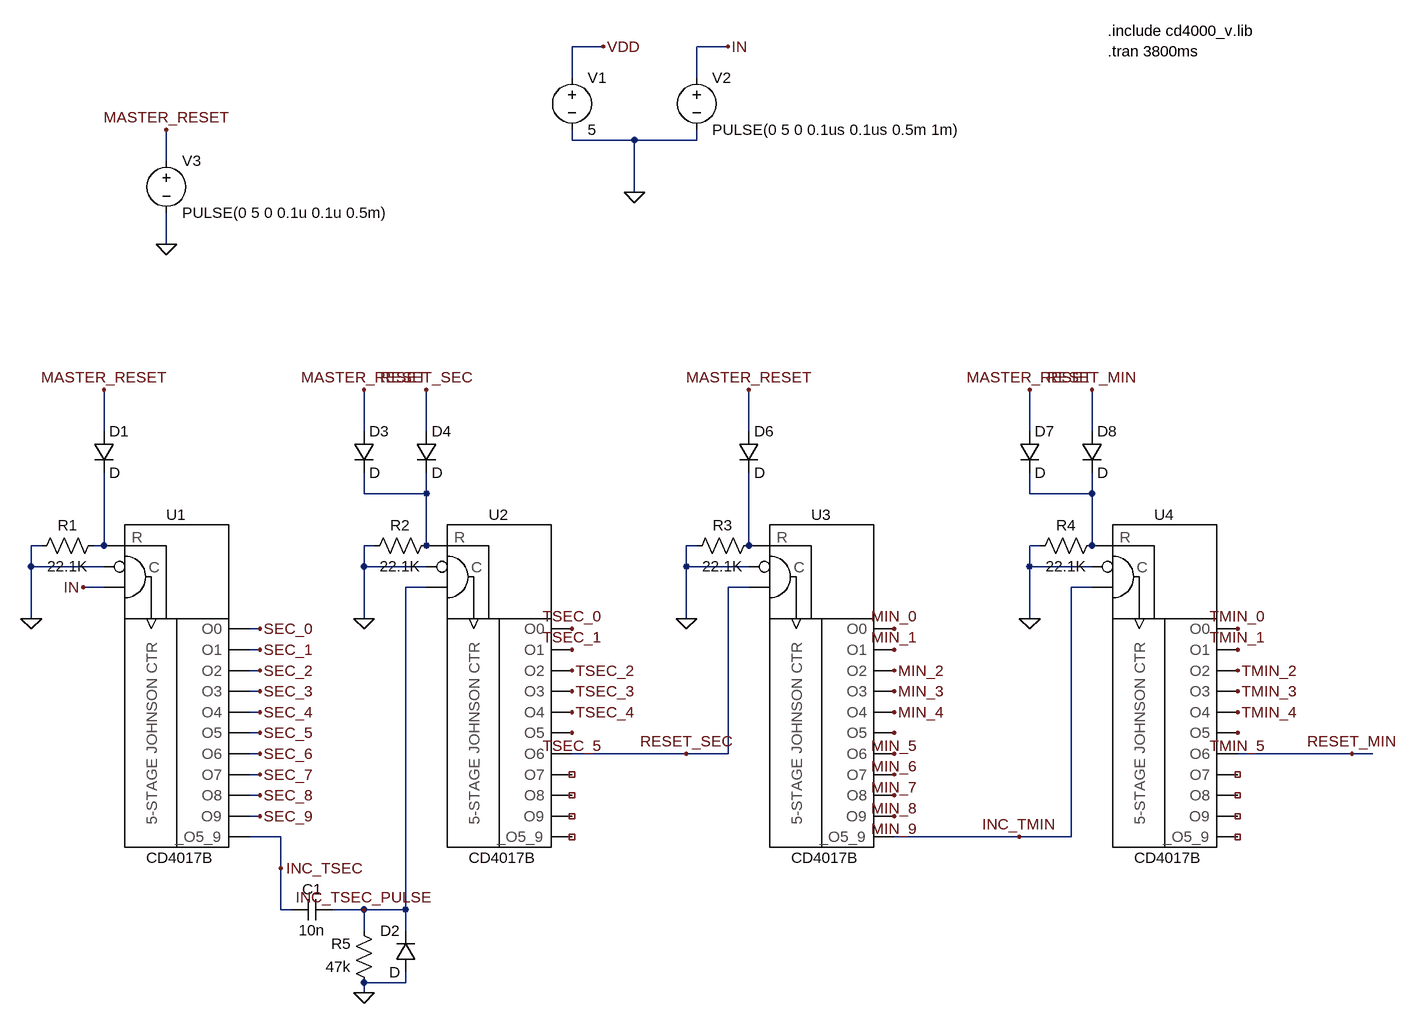
[diagram p0: schematic nixie_control.asc]
nixie_control.asc, the LTspice schematic file:
Version 4
SHEET 1 1592 1344
WIRE 368 -240 320 -240
WIRE 560 -240 512 -240
WIRE 320 -192 320 -240
WIRE 512 -192 512 -240
WIRE 320 -96 320 -112
WIRE 416 -96 320 -96
WIRE 512 -96 512 -112
WIRE 512 -96 416 -96
WIRE -304 -64 -304 -112
WIRE 416 -16 416 -96
WIRE -304 64 -304 16
WIRE -400 352 -400 288
WIRE 0 352 0 288
WIRE 96 352 96 288
WIRE 592 352 592 288
WIRE 1024 352 1024 288
WIRE 1120 352 1120 288
WIRE 0 448 0 416
WIRE 96 448 96 416
WIRE 96 448 0 448
WIRE 1024 448 1024 416
WIRE 1120 448 1120 416
WIRE 1120 448 1024 448
WIRE -496 528 -512 528
WIRE -400 528 -400 416
WIRE -400 528 -416 528
WIRE 16 528 0 528
WIRE 96 528 96 448
WIRE 512 528 496 528
WIRE 592 528 592 416
WIRE 1040 528 1024 528
WIRE 1120 528 1120 448
WIRE -512 560 -512 528
WIRE -400 560 -512 560
WIRE 0 560 0 528
WIRE 96 560 0 560
WIRE 496 560 496 528
WIRE 592 560 496 560
WIRE 1024 560 1024 528
WIRE 1120 560 1024 560
WIRE -400 592 -432 592
WIRE 96 592 64 592
WIRE 592 592 560 592
WIRE 1120 592 1088 592
WIRE -512 640 -512 560
WIRE 0 640 0 560
WIRE 496 640 496 560
WIRE 1024 640 1024 560
WIRE -160 656 -176 656
WIRE -160 688 -176 688
WIRE -160 720 -176 720
WIRE -160 752 -176 752
WIRE -160 784 -176 784
WIRE -160 816 -176 816
WIRE -160 848 -176 848
WIRE 496 848 320 848
WIRE 560 848 560 592
WIRE 560 848 496 848
WIRE 1520 848 1344 848
WIRE 1552 848 1520 848
WIRE -160 880 -176 880
WIRE -160 912 -176 912
WIRE -160 944 -176 944
WIRE -128 976 -176 976
WIRE 1008 976 816 976
WIRE 1088 976 1088 592
WIRE 1088 976 1008 976
WIRE -128 1024 -128 976
WIRE -128 1088 -128 1024
WIRE -112 1088 -128 1088
WIRE 0 1088 -48 1088
WIRE 64 1088 64 592
WIRE 64 1088 0 1088
WIRE 0 1120 0 1088
WIRE 64 1120 64 1088
WIRE 64 1200 64 1184
WIRE 64 1200 0 1200
WIRE 0 1216 0 1200
FLAG 416 -16 0
FLAG 368 -240 VDD
FLAG 560 -240 IN
FLAG -160 656 SEC_0
FLAG -160 688 SEC_1
FLAG -160 720 SEC_2
FLAG -160 752 SEC_3
FLAG -160 784 SEC_4
FLAG -160 816 SEC_5
FLAG -160 848 SEC_6
FLAG -160 880 SEC_7
FLAG -160 912 SEC_8
FLAG -160 944 SEC_9
FLAG -512 640 0
FLAG -432 592 IN
FLAG 0 640 0
FLAG 320 656 TSEC_0
FLAG 320 688 TSEC_1
FLAG 320 720 TSEC_2
FLAG 320 752 TSEC_3
FLAG 320 784 TSEC_4
FLAG 320 816 TSEC_5
FLAG 496 848 RESET_SEC
FLAG 96 288 RESET_SEC
FLAG -128 1024 INC_TSEC
FLAG -400 288 MASTER_RESET
FLAG 0 288 MASTER_RESET
FLAG -304 -112 MASTER_RESET
FLAG -304 64 0
FLAG 816 656 MIN_0
FLAG 816 688 MIN_1
FLAG 816 720 MIN_2
FLAG 816 752 MIN_3
FLAG 816 784 MIN_4
FLAG 816 816 MIN_5
FLAG 816 848 MIN_6
FLAG 816 880 MIN_7
FLAG 816 912 MIN_8
FLAG 816 944 MIN_9
FLAG 1024 640 0
FLAG 496 640 0
FLAG 1008 976 INC_TMIN
FLAG 1344 656 TMIN_0
FLAG 1344 688 TMIN_1
FLAG 1344 720 TMIN_2
FLAG 1344 752 TMIN_3
FLAG 1344 784 TMIN_4
FLAG 1344 816 TMIN_5
FLAG 592 288 MASTER_RESET
FLAG 1024 288 MASTER_RESET
FLAG 1520 848 RESET_MIN
FLAG 1120 288 RESET_MIN
FLAG 0 1088 INC_TSEC_PULSE
FLAG 0 1216 0
SYMBOL CD4017B -288 464 R0
SYMATTR InstName U1
SYMBOL voltage 320 -208 R0
SYMATTR InstName V1
SYMATTR Value 5
SYMBOL voltage 512 -208 R0
SYMATTR InstName V2
SYMATTR Value PULSE(0 5 0 0.1us 0.1us 0.5m 1m)
SYMBOL CD4017B 208 464 R0
SYMATTR InstName U2
SYMBOL res -400 512 R90
WINDOW 0 0 56 VBottom 2
WINDOW 3 32 56 VTop 2
SYMATTR InstName R1
SYMATTR Value 22.1K
SYMBOL res 112 512 R90
WINDOW 0 0 56 VBottom 2
WINDOW 3 32 56 VTop 2
SYMATTR InstName R2
SYMATTR Value 22.1K
SYMBOL diode -416 352 R0
SYMATTR InstName D1
SYMBOL diode -16 352 R0
SYMATTR InstName D3
SYMBOL diode 80 352 R0
SYMATTR InstName D4
SYMBOL voltage -304 -80 R0
SYMATTR InstName V3
SYMATTR Value PULSE(0 5 0 0.1u 0.1u 0.5m)
SYMBOL CD4017B 704 464 R0
SYMATTR InstName U3
SYMBOL CD4017B 1232 464 R0
SYMATTR InstName U4
SYMBOL res 608 512 R90
WINDOW 0 0 56 VBottom 2
WINDOW 3 32 56 VTop 2
SYMATTR InstName R3
SYMATTR Value 22.1K
SYMBOL res 1136 512 R90
WINDOW 0 0 56 VBottom 2
WINDOW 3 32 56 VTop 2
SYMATTR InstName R4
SYMATTR Value 22.1K
SYMBOL diode 576 352 R0
SYMATTR InstName D6
SYMBOL diode 1008 352 R0
SYMATTR InstName D7
SYMBOL diode 1104 352 R0
SYMATTR InstName D8
SYMBOL res 16 1216 R180
WINDOW 0 36 76 Left 2
WINDOW 3 36 40 Left 2
SYMATTR InstName R5
SYMATTR Value 47k
SYMBOL cap -48 1072 R90
WINDOW 0 0 32 VBottom 2
WINDOW 3 32 32 VTop 2
SYMATTR InstName C1
SYMATTR Value 10n
SYMBOL diode 80 1184 R180
WINDOW 0 24 64 Left 2
WINDOW 3 24 0 Left 2
SYMATTR InstName D2
TEXT 1144 -264 Left 2 !.include cd4000_v.lib\n.tran 3800ms

The netlist it stands for:
* nixie_control.asc
XU1 N003 0 IN SEC_0 SEC_1 SEC_2 SEC_3 SEC_4 SEC_5 SEC_6 SEC_7 SEC_8 SEC_9 INC_TSEC VDD 0 CD4017B VDD=5  SPEED=1.0  TRIPDT=5e-9  ; pins MR CPN CP Q0 Q1 Q2 Q3 Q4 Q5 Q6 Q7 Q8 Q9 Q59
V1 VDD 0 5
V2 IN 0 PULSE(0 5 0 0.1us 0.1us 0.5m 1m)
XU2 N001 0 INC_TSEC_PULSE TSEC_0 TSEC_1 TSEC_2 TSEC_3 TSEC_4 TSEC_5 RESET_SEC NC_01 NC_02 NC_03 NC_04 VDD 0 CD4017B VDD=5  SPEED=1.0  TRIPDT=5e-9  ; pins MR CPN CP Q0 Q1 Q2 Q3 Q4 Q5 Q6 Q7 Q8 Q9 Q59
R1 N003 0 22.1K
R2 N001 0 22.1K
D1 MASTER_RESET N003 D
D3 MASTER_RESET N001 D
D4 RESET_SEC N001 D
V3 MASTER_RESET 0 PULSE(0 5 0 0.1u 0.1u 0.5m)
XU3 N004 0 RESET_SEC MIN_0 MIN_1 MIN_2 MIN_3 MIN_4 MIN_5 MIN_6 MIN_7 MIN_8 MIN_9 INC_TMIN VDD 0 CD4017B VDD=5  SPEED=1.0  TRIPDT=5e-9  ; pins MR CPN CP Q0 Q1 Q2 Q3 Q4 Q5 Q6 Q7 Q8 Q9 Q59
XU4 N002 0 INC_TMIN TMIN_0 TMIN_1 TMIN_2 TMIN_3 TMIN_4 TMIN_5 RESET_MIN NC_05 NC_06 NC_07 NC_08 VDD 0 CD4017B VDD=5  SPEED=1.0  TRIPDT=5e-9  ; pins MR CPN CP Q0 Q1 Q2 Q3 Q4 Q5 Q6 Q7 Q8 Q9 Q59
R3 N004 0 22.1K
R4 N002 0 22.1K
D6 MASTER_RESET N004 D
D7 MASTER_RESET N002 D
D8 RESET_MIN N002 D
R5 0 INC_TSEC_PULSE 47k
C1 INC_TSEC_PULSE INC_TSEC 10n
D2 0 INC_TSEC_PULSE D
.model D D
.lib standard.dio
.include cd4000_v.lib
.tran 3800ms
.backanno
.end